# EAGLE schematic signal-a-1 (EAGLE 9.6.2)
AUTHOR: Balazs Racz; DRAWING_TITLE: MEB Schalterwerk Projekt; LICENSE: Licensed by the Solderpad Hardware License V2.0; REVIEWER: n/a; REVISION: A; YEAR: 2023
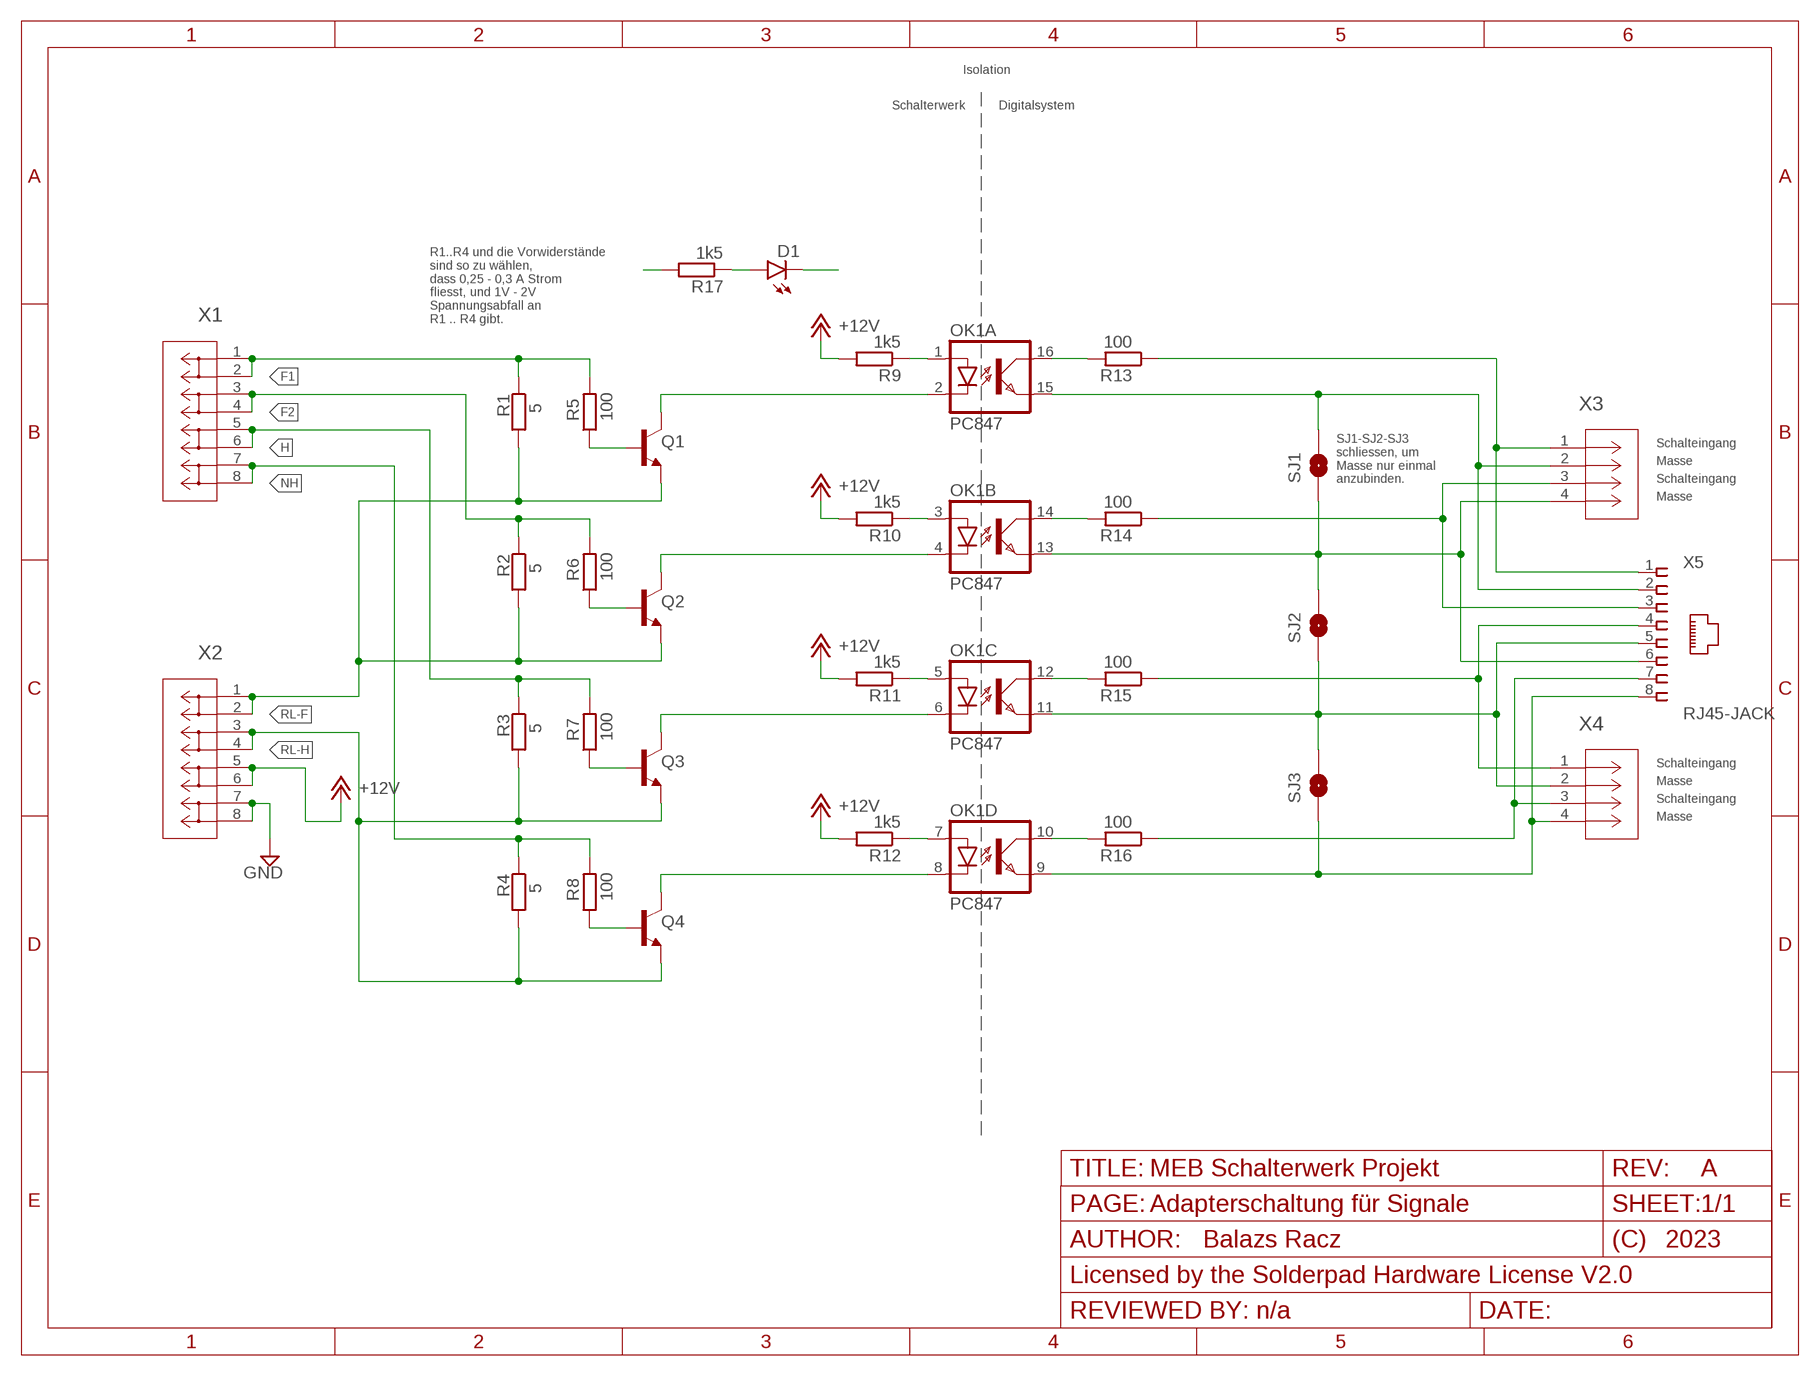
[diagram p0: schematic, sheet 1]
FRAME1 (FRAME_A_L): PAGE: Input ports
FRAME2 (FRAME_A_L): PAGE: Adapterschaltung für Signale

## Parts
D1  LEDCHIPLED_0603  [CHIPLED_0603]
OK1  PC847  [DIL16]
Q1  NPN-23  [SOT23]
Q2  NPN-23  [SOT23]
Q3  NPN-23  [SOT23]
Q4  NPN-23  [SOT23]
R1  5  R-EU_VTA52  [VTA52]
R2  5  R-EU_VTA52  [VTA52]
R3  5  R-EU_VTA52  [VTA52]
R4  5  R-EU_VTA52  [VTA52]
R5  100  R-EU_R0805  [R0805]
R6  100  R-EU_R0805  [R0805]
R7  100  R-EU_R0805  [R0805]
R8  100  R-EU_R0805  [R0805]
R9  1k5  R-EU_R0805  [R0805]
R10  1k5  R-EU_R0805  [R0805]
R11  1k5  R-EU_R0805  [R0805]
R12  1k5  R-EU_R0805  [R0805]
R13  100  R-EU_R0805  [R0805]
R14  100  R-EU_R0805  [R0805]
R15  100  R-EU_R0805  [R0805]
R16  100  R-EU_R0805  [R0805]
R17  1k5  R-EU_R0805  [R0805]
SJ1  SJRND2  [SJ_RND2]
SJ2  SJRND2  [SJ_RND2]
SJ3  SJRND2  [SJ_RND2]
X1  PHNX_4P_508CONN_1017493  [PHNX_4P_508]
X2  PHNX_4P_508CONN_1017493  [PHNX_4P_508]
X3  PHNX_4P_350CONN_1984989_PXC  [PHNX_4P_350]
X4  PHNX_4P_350CONN_1984989_PXC  [PHNX_4P_350]
X5  RJ45-JACK  RJ45-JACKRJ45-PULSE-E5J00  [RJ45-PULSE-E5J88]

## Nets
+12V: R9.2 R10.2 R11.2 R12.2 X2.5 X2.6
F1: R1.1 R5.2 X1.1 X1.2
F2: R2.1 R6.2 X1.3 X1.4
GND: X2.7 X2.8
GND1: D1.C
H: R3.1 R7.2 X1.5 X1.6
N$1: Q1.1(B) R5.1
N$2: OK1.2(A:C) Q1.3(C)
N$3: R13.1 X3.1 X5.1
N$4: OK1.15(A:EMIT) SJ1.P$2 X3.2 X5.2
N$5: OK1.1(A:A) R9.1
N$6: R14.1 X3.3 X5.3
N$7: Q2.1(B) R6.1
N$8: OK1.4(B:C) Q2.3(C)
N$9: OK1.3(B:A) R10.1
N$10: OK1.5(C:A) R11.1
N$11: OK1.7(D:A) R12.1
N$12: Q3.1(B) R7.1
N$13: OK1.6(C:C) Q3.3(C)
N$14: OK1.11(C:EMIT) SJ2.P$1 SJ3.P$2 X4.2 X5.5
N$15: R16.1 X4.3 X5.7
N$16: OK1.9(D:EMIT) SJ3.P$1 X4.4 X5.8
N$17: Q4.1(B) R8.1
N$18: OK1.8(D:C) Q4.3(C)
N$19: OK1.16(A:COL) R13.2
N$20: OK1.13(B:EMIT) SJ1.P$1 SJ2.P$2 X3.4 X5.6
N$21: OK1.14(B:COL) R14.2
N$22: OK1.12(C:COL) R15.2
N$23: OK1.10(D:COL) R16.2
N$24: R17.2
N$25: D1.A R17.1
N$26: R15.1 X4.1 X5.4
NH: R4.1 R8.2 X1.7 X1.8
RL-F: Q1.2(E) Q2.2(E) R1.2 R2.2 X2.1 X2.2
RL-H: Q3.2(E) Q4.2(E) R3.2 R4.2 X2.3 X2.4

## Notes on the sheet
- Isolation
- Schalterwerk | Digitalsystem
- R1..R4 und die Vorwiderstände
  sind so zu wählen,
  dass 0,25 - 0,3 A Strom
  fliesst, und 1V - 2V
  Spannungsabfall an
  R1 .. R4 gibt.
- Schalteingang
- Masse
- SJ1-SJ2-SJ3
  schliessen, um
  Masse nur einmal
  anzubinden.
- Schalteingang
- Masse
- Schalteingang
- Masse
- Schalteingang
- Masse

## Library data of the parts
D1 = led:LED: LED OSRAM: - CHIPLED LG R971, LG N971, LY N971, LG Q971, LY Q971, LO R971, LY R971 LH N974, LH R974 LS Q976, LO Q976, LY Q976 LO Q996 - Hyper CHIPLED LW Q18S LB Q993, LB Q99A, LB R99A - SideLED LS A670, LO A670, LY A670, LG A670, LP A670 LB A673, LV A673, LT A673, LW A673 LH A674 LY A675 LS A676, LA A676, LO A676, LY A676, LW A676 LS A679, LY A679, LG A679 - Hyper Micro SIDELED® LS Y876, LA Y876, LO Y876, LY Y876 LT Y87S - SmartLED LW L88C, LW L88S LB L89C, LB L89S, LG L890 LS L89K, LO L89K, LY L89K LS L896, LA L896, LO L896, LY L896 - TOPLED LS T670, LO T670, LY T670, LG T670, LP T670 LSG T670, LSP T670, LSY T670, LOP T670, LYG T670 LG T671, LOG T671, LSG T671 LB T673, LV T673, LT T673, LW T673 LH T674 LS T676, LA T676, LO T676, LY T676, LB T676, LH T676, LSB T676, LW T676 LB T67C, LV T67C, LT T67C, LS T67K, LO T67K, LY T67K, LW E67C LS E67B, LA E67B, LO E67B, LY E67B, LB E67C, LV E67C, LT E67C LW T67C LS T679, LY T679, LG T679 LS T770, LO T770, LY T770, LG T770, LP T770 LB T773, LV T773, LT T773, LW T773 LH T774 LS E675, LA E675, LY E675, LS T675 LS T776, LA T776, LO T776, LY T776, LB T776 LHGB T686 LT T68C, LB T68C - Hyper Mini TOPLED® LB M676 - Mini TOPLED Santana® LG M470 LS M47K, LO M47K, LY M47K Source: http://www.osram.convergy.de LUXEON: - LUMILED® LXK2-PW12-R00, LXK2-PW12-S00, LXK2-PW14-U00, LXK2-PW14-V00 LXK2-PM12-R00, LXK2-PM12-S00, LXK2-PM14-U00 LXK2-PE12-Q00, LXK2-PE12-R00, LXK2-PE12-S00, LXK2-PE14-T00, LXK2-PE14-U00 LXK2-PB12-K00, LXK2-PB12-L00, LXK2-PB12-M00, LXK2-PB14-N00, LXK2-PB14-P00, LXK2-PB14-Q00 LXK2-PR12-L00, LXK2-PR12-M00, LXK2-PR14-Q00, LXK2-PR14-R00 LXK2-PD12-Q00, LXK2-PD12-R00, LXK2-PD12-S00 LXK2-PH12-R00, LXK2-PH12-S00 LXK2-PL12-P00, LXK2-PL12-Q00, LXK2-PL12-R00 Source: www.luxeon.com KINGBRIGHT: KA-3528ASYC Source: www.kingbright.com
OK1 = optocoupler:PC847: SHARP OPTO COUPLER; OC_FARNELL: 9707735; OC_NEWARK: unknown
Q1-Q4 = eagleparts:NPN-23
R1-R17 = rcl:R-EU_: RESISTOR, European symbol; SPICEPREFIX: R
SJ1-SJ3 = eagleparts:SJ: SMD solder JUMPER
X1 X2 = eagleparts:PHNX_4P_508: https://www.digikey.com/en/products/detail/phoenix-contact/1017505/9346606 DigiKey 277-17516-ND; COPYRIGHT: Copyright (C) 2023 Ultra Librarian. All rights reserved.; MANUFACTURER_PART_NUMBER: 1017505; MFR_NAME: Phoenix Contact
X3 X4 = eagleparts:PHNX_4P_350: https://www.digikey.com/en/products/detail/phoenix-contact/1984989/2513979 DigiKey 277-6404-ND; COPYRIGHT: Copyright (C) 2023 Ultra Librarian. All rights reserved.; MANUFACTURER_PART_NUMBER: 1984989; MFR_NAME: Phoenix Contact
X5 = trainlib:RJ45-JACK: Mod. Jack, Right Angle, 8 posiotion, 8 contatcs RJ45 Source: GLX-S-88M.pdf